# Altium schematic sheet Flash烧录器STM32版.schdoc
size 250 x 170 mm
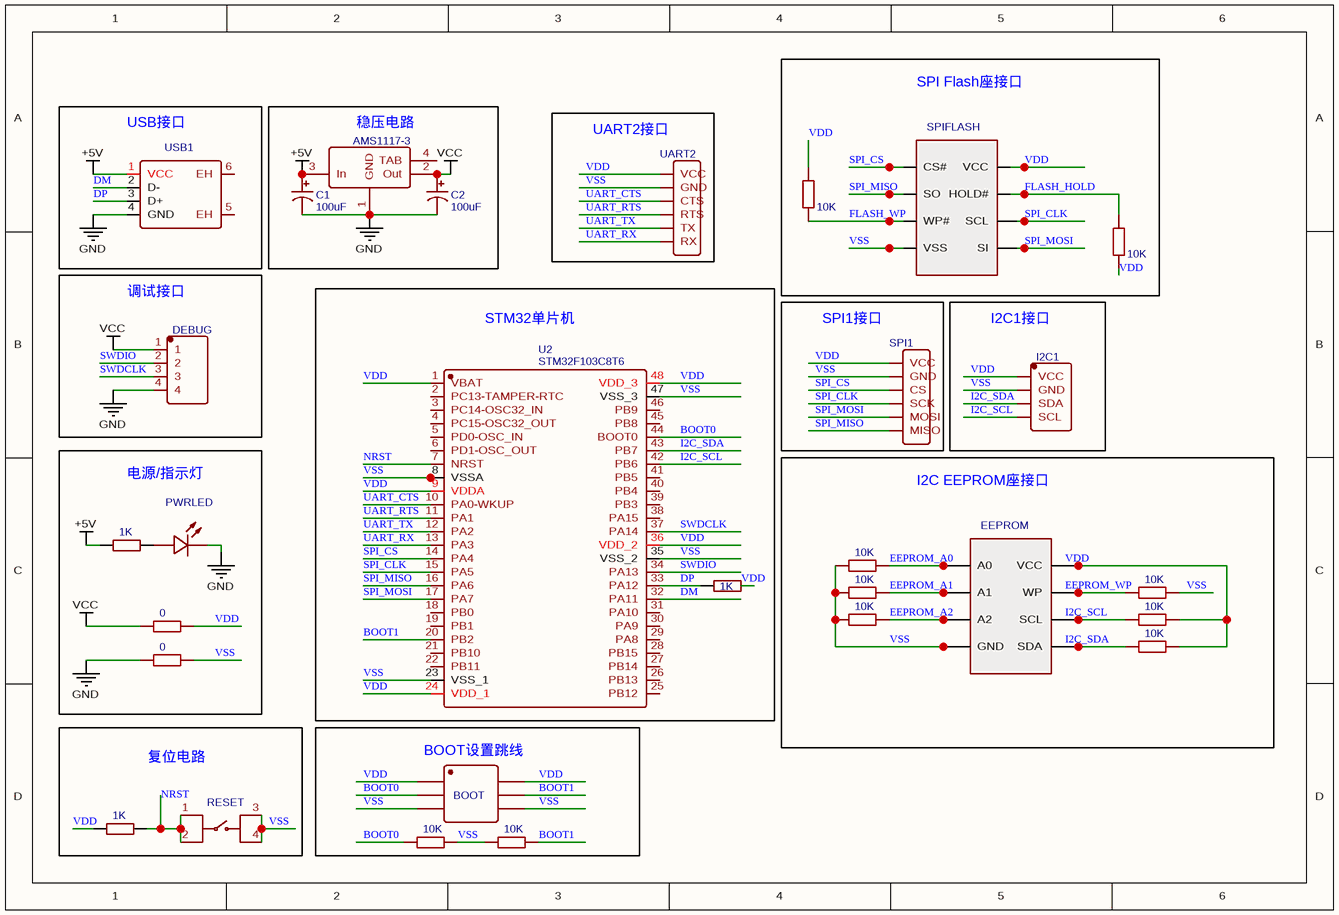
[diagram p0: Flash烧录器STM32版.schdoc]

## Parts
AMS1117-3  AMS1117-3.3_C165482  [SOT-223_L6.5-W3.5-P2.30-LS7.0-BR]  (value not drawn)
BOOT  210S-2*3P L=11.6MMGold-plated black  [HDR-TH_6P-P2.54-V-R2-C3-S2.54]  (value not drawn)
C1  100uF  [CAP-SMD_BD5.0-L5.3-W5.3-FD]
C2  100uF  [CAP-SMD_BD5.0-L5.3-W5.3-FD]
DEBUG  MTP125-1104S1  [HDR-TH_4P-P2.54-V]  (value not drawn)
EEPROM  DS1009-08AT1NX-0A2  [DIP-8_L10.0-W6.5-P2.54-LS7.6-BL]  (value not drawn)
I2C1  MTP125-1104S1  [HDR-TH_4P-P2.54-V]  (value not drawn)
PWRLED  MHL3014SRTS  [LED-TH_BD3.0-P2.54-FD]  (value not drawn)
R1  1K  [R0603]
R2  1K  [R0603]
R3  10K  [R1206]
R4  10K  [R1206]
R5  10K  [R1206]
R6  10K  [R1206]
R7  10K  [R1206]
R8  10K  [R1206]
R9  10K  [R1206]
R10  10K  [R1206]
R11  10K  [R1206]
R12  10K  [R1206]
R13  0  [R0805]
R14  0  [R0805]
R15  1K  [R0603]
RESET  K2-6639SP-C4SC-04  [KEY-SMD_4P-L6.0-W6.0-P3.90-LS10.0]  (value not drawn)
SPI1  Header-Male-2.54_1x6  [HDR-TH_6P-P2.54-V]  (value not drawn)
SPIFLASH  DS1009-08AT1NX-0A2  [DIP-8_L10.0-W6.5-P2.54-LS7.6-BL]  (value not drawn)
U2  STM32F103C8T6  [LQFP-48_L7.0-W7.0-P0.50-LS9.0-BL]
UART2  Header-Male-2.54_1x6  [HDR-TH_6P-P2.54-V]  (value not drawn)
USB1  USB-05  [USB-A-TH_48037-0001]  (value not drawn)

## Blocks framed on the sheet
SPI Flash座接口: R5 R6 SPIFLASH
USB接口: USB1
稳压电路: AMS1117-3 C1 C2
UART2接口: UART2
调试接口: DEBUG
STM32单片机: R15 U2
SPI1接口: SPI1
I2C1接口: I2C1
电源/指示灯: PWRLED R1 R13 R14
I2C EEPROM座接口: EEPROM R7-R12
复位电路: R2 RESET
BOOT设置跳线: BOOT R3 R4

## Nets
+5V: AMS1117-3.3(In) C1.1 R1.1 USB1.1(VCC)
GND: AMS1117-3.1(GND) C1.2 C2.2 DEBUG.4 PWRLED.2(K) R14.1 USB1.4(GND)
VCC: AMS1117-3.2(Out) C2.1 DEBUG.1 R13.1
BOOT0: BOOT.3 R3.1 U2.44(BOOT0)
BOOT1: BOOT.4 R4.2 U2.20(PB2)
DM: U2.32(PA11) USB1.2(D-)
DP: R15.1 U2.33(PA12) USB1.3(D+)
EEPROM_A0: EEPROM.1(A0) R8.1
EEPROM_A1: EEPROM.2(A1) R11.1
EEPROM_A2: EEPROM.3(A2) R12.1
EEPROM_WP: EEPROM.7(WP) R10.2
FLASH_HOLD: R6.2 SPIFLASH.7(HOLD#)
FLASH_WP: R5.1 SPIFLASH.3(WP#)
I2C_SCL: EEPROM.6(SCL) I2C1.4(SCL) R9.2 U2.42(PB6)
I2C_SDA: EEPROM.5(SDA) I2C1.3(SDA) R7.2 U2.43(PB7)
NRST: R2.2 RESET.1 RESET.2 U2.7(NRST)
SPI_CLK: SPI1.4(SCK) SPIFLASH.6(SCL) U2.15(PA5)
SPI_CS: SPI1.3(CS) SPIFLASH.1(CS#) U2.14(PA4)
SPI_MISO: SPI1.6(MISO) SPIFLASH.2(SO) U2.16(PA6)
SPI_MOSI: SPI1.5(MOSI) SPIFLASH.5(SI) U2.17(PA7)
SWDCLK: DEBUG.3 U2.37(PA14)
SWDIO: DEBUG.2 U2.34(PA13)
UART_CTS: U2.10(PA0-WKUP) UART2.3(CTS)
UART_RTS: U2.11(PA1) UART2.4(RTS)
UART_RX: U2.13(PA3) UART2.6(RX)
UART_TX: U2.12(PA2) UART2.5(TX)
VDD: BOOT.1 BOOT.2 EEPROM.8(VCC) I2C1.1(VCC) R2.1 R5.2 R6.1 R7.1 R9.1 R13.2 R15.2 SPI1.1(VCC) SPIFLASH.8(VCC) U2.1(VBAT) U2.9(VDDA) U2.24(VDD_1) U2.36(VDD_2) U2.48(VDD_3) UART2.1(VCC)
VSS: BOOT.5 BOOT.6 EEPROM.4(GND) I2C1.2(GND) R3.2 R4.1 R8.2 R10.1 R11.2 R12.2 R14.2 RESET.3 RESET.4 SPI1.2(GND) SPIFLASH.4(VSS) U2.8(VSSA) U2.23(VSS_1) U2.35(VSS_2) U2.47(VSS_3) UART2.2(GND)
NetPWRLED_1: PWRLED.1(A) R1.2

Not connected (* = marked no-connect by the designer): AMS1117-3 4(TAB); U2 2(PC13-TAMPER-RTC) 3(PC14-OSC32_IN) 4(PC15-OSC32_OUT) 5(PD0-OSC_IN) 6(PD1-OSC_OUT) 18(PB0) 19(PB1) 21(PB10) 22(PB11) 25(PB12) 26(PB13) 27(PB14) 28(PB15) 29(PA8) 30(PA9) 31(PA10) 38(PA15) 39(PB3) 40(PB4) 41(PB5) 45(PB8) 46(PB9); USB1 5(EH) 6(EH)

## Library data of the parts
AMS1117-3 = AMS1117-3.3_C165482: BOM_Manufacturer: SK; Contributor: LCSC; SMT Type: Extend; Package Display: No; BOM_Supplier: LCSC; BOM_Supplier Part: C165482; BOM_Manufacturer Part: AMS1117-3.3; BOM_LCSC Assembly: Yes; spicePre: U; spiceSymbolName: AMS1117-3.3_C165482
BOOT = 210S-2*3P L=11.6MMGold-plated black: BOM_Manufacturer: Ckmtw; Contributor: LCSC; Package Display: No; BOM_Supplier: LCSC; BOM_Manufacturer Part: 210S-2*3P L=11.6MMGold-plated black; BOM_Supplier Part: C124384; spicePre: H; spiceSymbolName: 210S-2*3P L=11.6MMGold-plated black
C1 C2 = 100uF: BOM_Manufacturer: HONOR; BOM_Manufacturer Part: RVT1A101M0505; nameAlias: Capacitance; BOM_Supplier: LCSC; BOM_Supplier Part: C3347; spicePre: C; spiceSymbolName: RVT1A101M0505-C3347
DEBUG I2C1 = MTP125-1104S1: BOM_Manufacturer: MINTRON; Contributor: LCSC; Package Display: No; BOM_Supplier: LCSC; BOM_Supplier Part: C358686; BOM_Manufacturer Part: MTP125-1104S1; spicePre: U; spiceSymbolName: MTP125-1104S1
EEPROM SPIFLASH = DS1009-08AT1NX-0A2: BOM_Manufacturer: CONNFLY; Package Display: No; BOM_Supplier: LCSC; BOM_Manufacturer Part: DS1009-08AT1NX-0A2; image: //image.lceda.cn/szlcsc/C72124.jpg; BOM_Supplier Part: C72124; spicePre: U; spiceSymbolName: DS1009-08AT1NX-0A2
PWRLED = MHL3014SRTS: BOM_Manufacturer: MEIHUA; Contributor: LCSC; Package Display: No; BOM_Supplier: LCSC; BOM_Supplier Part: C397053; BOM_Manufacturer Part: MHL3014SRTS; spicePre: L; spiceSymbolName: MHL3014SRTS
R1 R2 R15 = 1K: BOM_Manufacturer: UniOhm; BOM_Manufacturer Part: 0603WAF1001T5E; nameAlias: Resistance (Ohms); SMT Type: Basic; Package Display: No; BOM_Supplier: LCSC; BOM_LCSC Assembly: Yes; BOM_Supplier Part: C21190; spicePre: R; spiceSymbolName: 0603WAF1001T5E
R3-R12 = 10K: BOM_Manufacturer: Stackpole Elec; BOM_Manufacturer Part: RMCF1206JT10K0; nameAlias: Resistance (Ohms); Contributor: LCSC; Package Display: No; BOM_Supplier: LCSC; BOM_Supplier Part: C237800; spicePre: R; spiceSymbolName: RMCF1206JT10K0
R13 R14 = 0: BOM_Manufacturer: TA-I Tech; BOM_Manufacturer Part: RM10FTN0; nameAlias: Resistance (Ohms); Contributor: LCSC; Package Display: No; BOM_Supplier: LCSC; BOM_Supplier Part: C254574; spicePre: R; spiceSymbolName: RM10FTN0
RESET = K2-6639SP-C4SC-04: BOM_Manufacturer: HRO; Package Display: No; BOM_Supplier: LCSC; BOM_Manufacturer Part: K2-6639SP-C4SC-04; BOM_Supplier Part: C83206; spicePre: S; spiceSymbolName: K2-6639SP-C4SC-04
SPI1 UART2 = Header-Male-2.54_1x6: BOM_Manufacturer: BOOMELE; Package Display: No; BOM_Supplier: LCSC; BOM_Manufacturer Part: Header-Male-2.54_1x6; BOM_Supplier Part: C37208; spicePre: H; spiceSymbolName: Header-Male-2.54_1x6
U2 = STM32F103C8T6: BOM_Manufacturer: STMicroelectronics; SMT Type: Basic; timeStamp: 1455028086; BOM_Supplier: LCSC; BOM_Manufacturer Part: STM32F103C8T6; BOM_LCSC Assembly: Yes; image: //image.lceda.cn/szlcsc/C8734.jpg; BOM_Supplier Part: C8734; spicePre: U; spiceSymbolName: STM32F103C8T6
USB1 = USB-05: BOM_Manufacturer: SOFNG; Contributor: LCSC; Package Display: No; BOM_Supplier: LCSC; BOM_Manufacturer Part: USB-05; BOM_Supplier Part: C112454; spicePre: U; spiceSymbolName: USB-05